# EAGLE design lpc11u24mini (EAGLE 6.6.0)
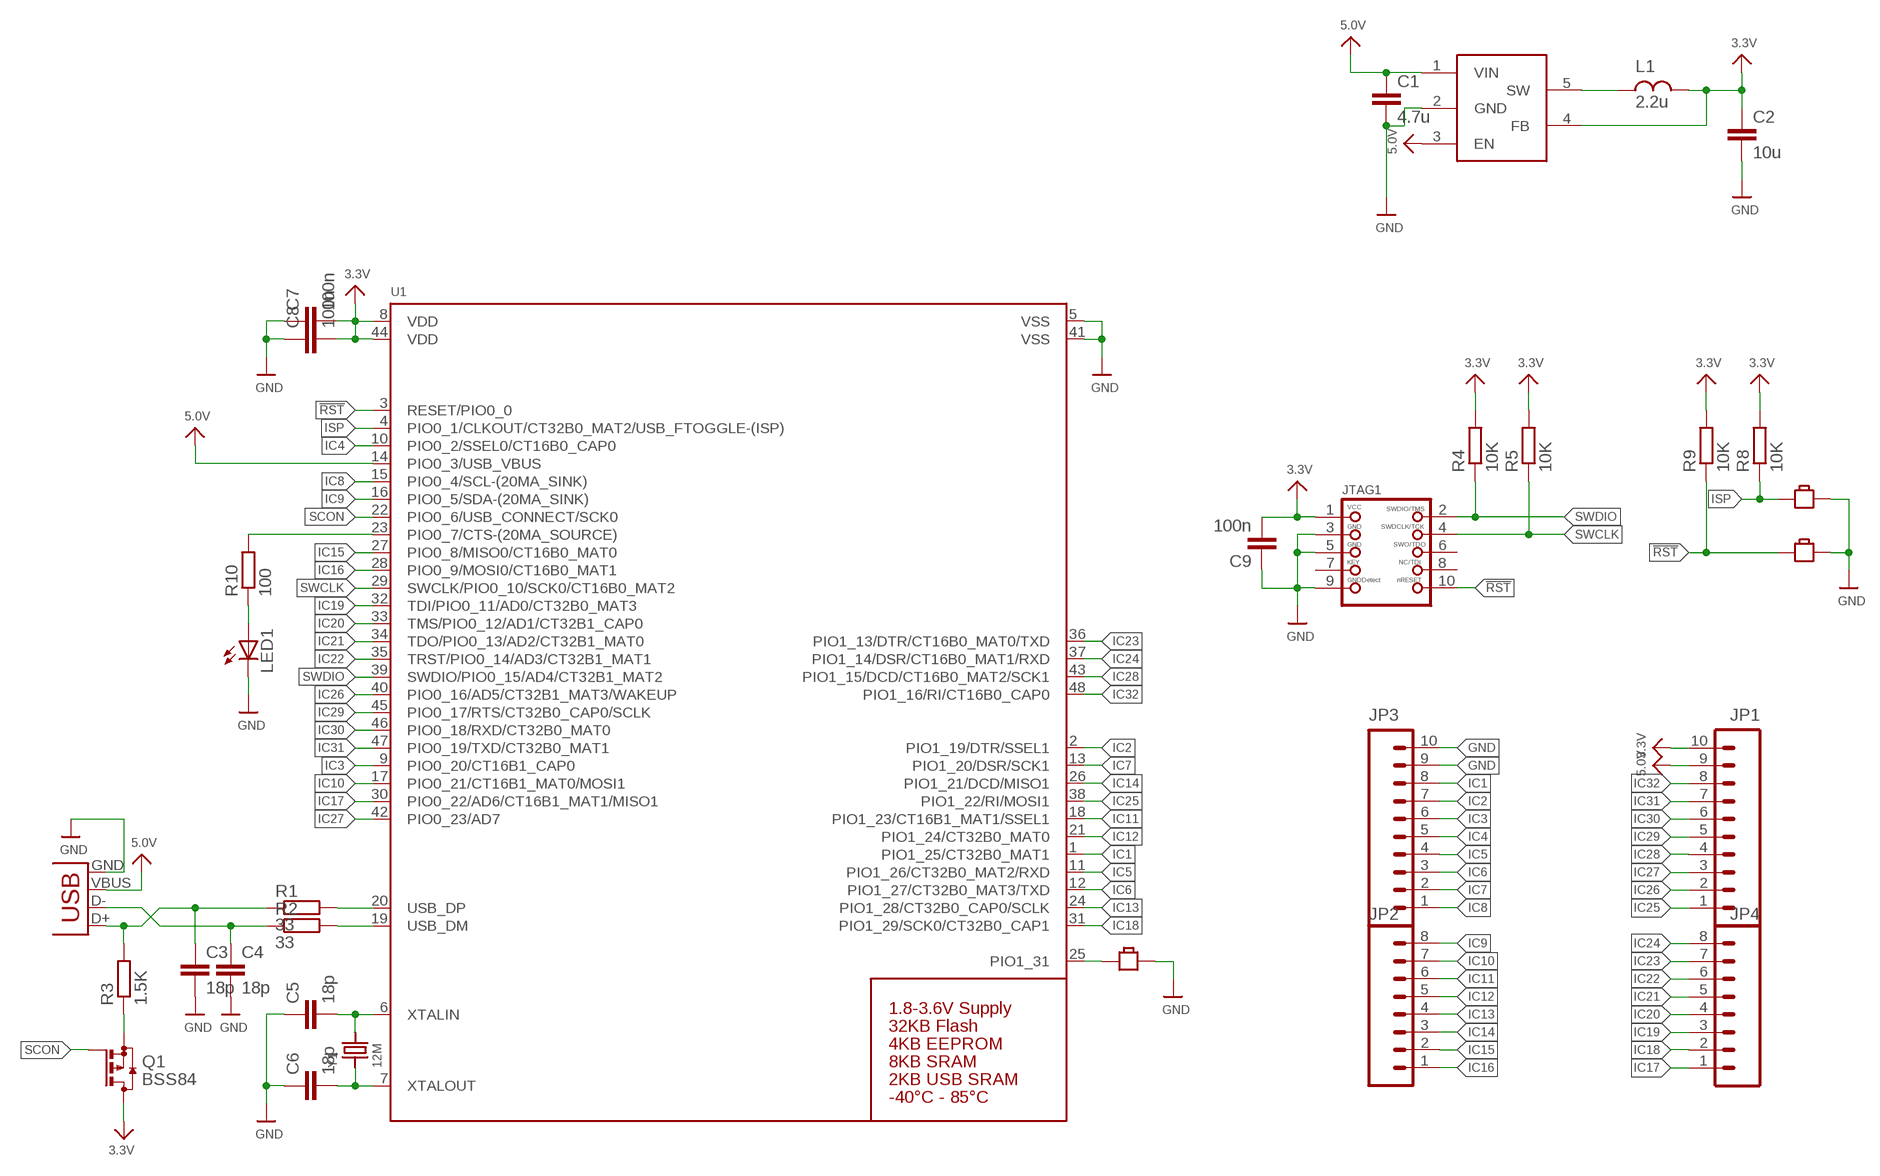
[diagram p0: schematic, sheet 1]

## Parts
B1  BUTTON-SMD-2P  [BUTTON_2P_SMD]
B2  BUTTON-SMD-2P  [BUTTON_2P_SMD]
B3  BUTTON-SMD-2P  [BUTTON_2P_SMD]
C1  4.7u  C-EUC0603  [C0603]
C2  10u  C-EUC0603  [C0603]
C3  18p  C-EUC0603  [C0603]
C4  18p  C-EUC0603  [C0603]
C5  18p  C-EUC0603  [C0603]
C6  18p  C-EUC0603  [C0603]
C7  100n  C-EUC0603  [C0603]
C8  100n  C-EUC0603  [C0603]
C9  100n  C-EUC0603  [C0603]
JP1  M10SMD_MALE  [1X10_SMD_MALE]
JP2  M08SMD-MALE  [1X08_SMD_MALE]
JP3  M10SMD_MALE  [1X10_SMD_MALE]
JP4  M08SMD-MALE  [1X08_SMD_MALE]
JTAG1  JTAG-CORTEXM3  [2X05_1.27MM_SMT]
L1  2.2u  L_SNR2512  [SRN2512]
LED1  LEDSML0805  [SML0805]
Q1  BSS84  [SOT23]
R1  33  R-EU_R0603  [R0603]
R2  33  R-EU_R0603  [R0603]
R3  1.5K  R-EU_R0603  [R0603]
R4  10K  R-EU_R0603  [R0603]
R5  10K  R-EU_R0603  [R0603]
R8  10K  R-EU_R0603  [R0603]
R9  10K  R-EU_R0603  [R0603]
R10  100  R-EU_R0603  [R0603]
U1  LPC11U24_QFP48  [LQFP48]
U$3  LM3671  [SOT23-5]
X1  USB-MICROB  [USB-MICROB]
Y1  12M  CRYSTALTHIN  [CRYSTAL_3.2X2.5]

## Nets
3.3V: C2.1 C7.2 C8.2 C9.2 JP1.10 JTAG1.1 L1.P$2 Q1.3(D) R4.2 R5.2 R8.2 R9.2 U1.8(VDD) U1.44(VDD) U$3.4(FB)
5.0V: C1.1 JP1.9 U1.14(PIO0_3/USB_VBUS) U$3.1(VIN) U$3.3(EN) X1.VBUS
!RST: B2.1 JTAG1.10 R9.1 U1.3(RESET/PIO0_0)
D_N: C4.1 R2.1 X1.D-
D_P: C3.1 R1.1 R3.2 X1.D+
DR_N: R2.2 U1.19(USB_DM)
DR_P: R1.2 U1.20(USB_DP)
GND: B1.P$2 B2.P$2 B3.P$2 C1.2 C2.2 C3.2 C4.2 C5.1 C6.1 C7.1 C8.1 C9.1 JP3.9 JP3.10 JTAG1.3 JTAG1.5 JTAG1.9 LED1.C U1.5(VSS) U1.41(VSS) U$3.2(GND) X1.GND
IC1: JP3.8 U1.1(PIO1_25/CT32B0_MAT1)
IC2: JP3.7 U1.2(PIO1_19/DTR/SSEL1)
IC3: JP3.6 U1.9(PIO0_20/CT16B1_CAP0)
IC4: JP3.5 U1.10(PIO0_2/SSEL0/CT16B0_CAP0)
IC5: JP3.4 U1.11(PIO1_26/CT32B0_MAT2/RXD)
IC6: JP3.3 U1.12(PIO1_27/CT32B0_MAT3/TXD)
IC7: JP3.2 U1.13(PIO1_20/DSR/SCK1)
IC8: JP3.1 U1.15(PIO0_4/SCL-(20MA_SINK))
IC9: JP2.8 U1.16(PIO0_5/SDA-(20MA_SINK))
IC10: JP2.7 U1.17(PIO0_21/CT16B1_MAT0/MOSI1)
IC11: JP2.6 U1.18(PIO1_23/CT16B1_MAT1/SSEL1)
IC12: JP2.5 U1.21(PIO1_24/CT32B0_MAT0)
IC13: JP2.4 U1.24(PIO1_28/CT32B0_CAP0/SCLK)
IC14: JP2.3 U1.26(PIO1_21/DCD/MISO1)
IC15: JP2.2 U1.27(PIO0_8/MISO0/CT16B0_MAT0)
IC16: JP2.1 U1.28(PIO0_9/MOSI0/CT16B0_MAT1)
IC17: JP4.1 U1.30(PIO0_22/AD6/CT16B1_MAT1/MISO1)
IC18: JP4.2 U1.31(PIO1_29/SCK0/CT32B0_CAP1)
IC19: JP4.3 U1.32(TDI/PIO0_11/AD0/CT32B0_MAT3)
IC20: JP4.4 U1.33(TMS/PIO0_12/AD1/CT32B1_CAP0)
IC21: JP4.5 U1.34(TDO/PIO0_13/AD2/CT32B1_MAT0)
IC22: JP4.6 U1.35(TRST/PIO0_14/AD3/CT32B1_MAT1)
IC23: JP4.7 U1.36(PIO1_13/DTR/CT16B0_MAT0/TXD)
IC24: JP4.8 U1.37(PIO1_14/DSR/CT16B0_MAT1/RXD)
IC25: JP1.1 U1.38(PIO1_22/RI/MOSI1)
IC26: JP1.2 U1.40(PIO0_16/AD5/CT32B1_MAT3/WAKEUP)
IC27: JP1.3 U1.42(PIO0_23/AD7)
IC28: JP1.4 U1.43(PIO1_15/DCD/CT16B0_MAT2/SCK1)
IC29: JP1.5 U1.45(PIO0_17/RTS/CT32B0_CAP0/SCLK)
IC30: JP1.6 U1.46(PIO0_18/RXD/CT32B0_MAT0)
IC31: JP1.7 U1.47(PIO0_19/TXD/CT32B0_MAT1)
IC32: JP1.8 U1.48(PIO1_16/RI/CT16B0_CAP0)
ISP: B1.1 R8.1 U1.4(PIO0_1/CLKOUT/CT32B0_MAT2/USB_FTOGGLE-(ISP))
LED: R10.2 U1.23(PIO0_7/CTS-(20MA_SOURCE))
N$1: B3.1 U1.25(PIO1_31)
N$3: L1.P$1 U$3.5(SW)
N$4: Q1.2(S) R3.1
N$5: C6.2 U1.7(XTALOUT) Y1.1
N$6: C5.2 U1.6(XTALIN) Y1.2
N$7: LED1.A R10.1
SCON: Q1.1(G) U1.22(PIO0_6/USB_CONNECT/SCK0)
SWCLK: JTAG1.4 R5.1 U1.29(SWCLK/PIO0_10/SCK0/CT16B0_MAT2)
SWDIO: JTAG1.2 R4.1 U1.39(SWDIO/PIO0_15/AD4/CT32B1_MAT2)
Unconnected: JTAG1.6 JTAG1.7 JTAG1.8

## Library data of the parts
B1-B3 = JAEB:BUTTON-SMD-2P: BAS014
C1-C9 = rcl:C-EU: CAPACITOR, European symbol
JP1 JP3 = SparkFun-Connectors:M10: Header 10 Standard 10-pin 0.1" header. Use with straight break away headers (SKU : PRT-00116), right angle break away headers (PRT-00553), swiss pins (PRT-00743), machine pins (PRT-00117), and female headers (PRT-00115).; PROD_ID: CONN-11291
JP2 JP4 = SparkFun-Connectors:M08: Header 8 Standard 8-pin 0.1" header. Use with straight break away headers (SKU : PRT-00116), right angle break away headers (PRT-00553), swiss pins (PRT-00743), machine pins (PRT-00117), and female headers (PRT-00115).; PROD_ID: CONN-11292
JTAG1 = microbuilder:JTAG-CORTEXM3: Serial Wire (SW-DP) Connector This standard 0.05" 10-pin connector is for use with the Cortex M0/M3's native SWD (serial wire debugger) interface (SW-DP). Some boards support a 20-pin combined JTAG+SWD connector (SWJ-DP), such as the LPC1700 family, but many smaller devices only work with SWD which typically use the smaller 10-pin SW-DP connecter (the LPC1300 family, for example, only supports SWD). 2x05 1.27mm/0.05" Connector: This is the standard SMT connector defined by ARM for all Cortex devices, and should be used in most situations and for forward-compatibility since any new devices coming to market will likely use this connector. MOLEX 10 Pin 0.1" Connector: This 0.1" 10 pin connector has the same pin layout as the standard 0.05" connector, but is easier to work with if you are using standard jumper wires or custom cables to connect your SWD hardware. MOLEX 20 Pin 0.1" Connector: This 0.1" 20 pin connector is the same model used for ARM7/ARM9 JTAG debuggers, but is connected to match the pins on the Segger J-Link for ARM (which supports both JTAG and SWD debugging). See the following document from ARM for more information on Cortex M3 Debug Connectors: http://infocenter.arm.com/help/topic/com.arm.doc.faqs/attached/13634/cortex_debug_connectors.pdf And the following page for an overview with images of the different connector types: http://www.keil.com/peripherals/coresight/connectors.asp
L1 = JAEB:L
LED1 = led:LED: LED OSRAM: - CHIPLED LG R971, LG N971, LY N971, LG Q971, LY Q971, LO R971, LY R971 LH N974, LH R974 LS Q976, LO Q976, LY Q976 LO Q996 - Hyper CHIPLED LW Q18S LB Q993, LB Q99A, LB R99A - SideLED LS A670, LO A670, LY A670, LG A670, LP A670 LB A673, LV A673, LT A673, LW A673 LH A674 LY A675 LS A676, LA A676, LO A676, LY A676, LW A676 LS A679, LY A679, LG A679 - Hyper Micro SIDELED® LS Y876, LA Y876, LO Y876, LY Y876 LT Y87S - SmartLED LW L88C, LW L88S LB L89C, LB L89S, LG L890 LS L89K, LO L89K, LY L89K LS L896, LA L896, LO L896, LY L896 - TOPLED LS T670, LO T670, LY T670, LG T670, LP T670 LSG T670, LSP T670, LSY T670, LOP T670, LYG T670 LG T671, LOG T671, LSG T671 LB T673, LV T673, LT T673, LW T673 LH T674 LS T676, LA T676, LO T676, LY T676, LB T676, LH T676, LSB T676, LW T676 LB T67C, LV T67C, LT T67C, LS T67K, LO T67K, LY T67K, LW E67C LS E67B, LA E67B, LO E67B, LY E67B, LB E67C, LV E67C, LT E67C LW T67C LS T679, LY T679, LG T679 LS T770, LO T770, LY T770, LG T770, LP T770 LB T773, LV T773, LT T773, LW T773 LH T774 LS E675, LA E675, LY E675, LS T675 LS T776, LA T776, LO T776, LY T776, LB T776 LHGB T686 LT T68C, LB T68C - Hyper Mini TOPLED® LB M676 - Mini TOPLED Santana® LG M470 LS M47K, LO M47K, LY M47K Source: http://www.osram.convergy.de LUXEON: - LUMILED® LXK2-PW12-R00, LXK2-PW12-S00, LXK2-PW14-U00, LXK2-PW14-V00 LXK2-PM12-R00, LXK2-PM12-S00, LXK2-PM14-U00 LXK2-PE12-Q00, LXK2-PE12-R00, LXK2-PE12-S00, LXK2-PE14-T00, LXK2-PE14-U00 LXK2-PB12-K00, LXK2-PB12-L00, LXK2-PB12-M00, LXK2-PB14-N00, LXK2-PB14-P00, LXK2-PB14-Q00 LXK2-PR12-L00, LXK2-PR12-M00, LXK2-PR14-Q00, LXK2-PR14-R00 LXK2-PD12-Q00, LXK2-PD12-R00, LXK2-PD12-S00 LXK2-PH12-R00, LXK2-PH12-S00 LXK2-PL12-P00, LXK2-PL12-Q00, LXK2-PL12-R00 Source: www.luxeon.com KINGBRIGHT: KA-3528ASYC Source: www.kingbright.com
Q1 = transistor-small-signal:BSS84: P-CHANNEL MOS FET
R1-R5 R8-R10 = rcl:R-EU_: RESISTOR, European symbol
U1 = microbuilder:LPC11U24_QFP48: LPC11U24 - ARM Cortex M0 50MHz MCU Supply: 1.8-3.6V Flash: 32KB EEPROM: 4KB SRAM: 8KB + 2KB USB Temp: -40°C - 85°C
U$3 = JAEB:LM3671
X1 = brc-electronics:USB: USB Connectors USB-B-PTH is fully proven SKU : PRT-00139 USB-miniB is fully proven SKU : PRT-00587 USB-A-PCB is untested. USB-A-H is throughly reviewed, but untested. Spark Fun Electronics SKU : PRT-00437 USB-B-SMT is throughly reviewed, but untested. Needs silkscreen touching up. USB-A-S has not been used/tested USB-MB-H has not been used/tested
Y1 = microbuilder:CRYSTAL: Crystals HC49UP - Surface Mount Crystal 4.0MHz 18pF +/-30ppm Surface Mount Crystal [Digikey: 535-9857-1-ND] 12.0 MHz Surface Mount Crystal [Digikey: 535-9869-6-ND] 25.0 MHz Surface Mount Crystal [Digikey: 535-9078-1-ND] 2.5 x 2.0mm - MEMs SMT Crystal 16.0 MHz 10pF 20ppm 2.5 x 2.0mm Crystal [Digikey -40-85°C: 535-10923-1-ND] 3.2 x 2.5mm - MEMs SMT Crystal 12.0 MHz 8pF 15ppm 3.2 x 2.5mm Crystal [Digikey: -10-70°C: 644-1047-1-ND -40-125°C: 644-1128-1-ND] 16.0 MHz 8pF 15ppm 3.2 x 2.5mm Crystal [Digikey: -10-70°C: 644-1049-1-ND -40-125°C: 644-1129-2-ND] 16.0 MHz 10pF 10ppm 3.2 x 2.5mm Crystal [Digikey: 644-1100-1-ND] 27.12 MHz 18pF 30ppm 3.2 x 2.5mm Crystal [Digikey: 887-1424-1-ND] 27.12MHz 10pF 10ppm 3.2 x 2.5mm Crystal [Digikey: 887-1329-1-ND] 4.9 x 1.8mm - MEMs SMT Crystal 32.768 KHz 12.5pF 20ppm 4.9 x 1.8mm Crystal [Digikey: SE2415CT-ND] 8.0 x 3.8mm - Surface Mount Crystal 32.768kHz 12.5pF 20ppm -40°C-85°C [Digikey: 535-9166-2-ND] Cylinder 32.768KHz Cylinder Crystal (2x6mm body) [Ex. Digikey: 300-8341-2-ND]

## Board
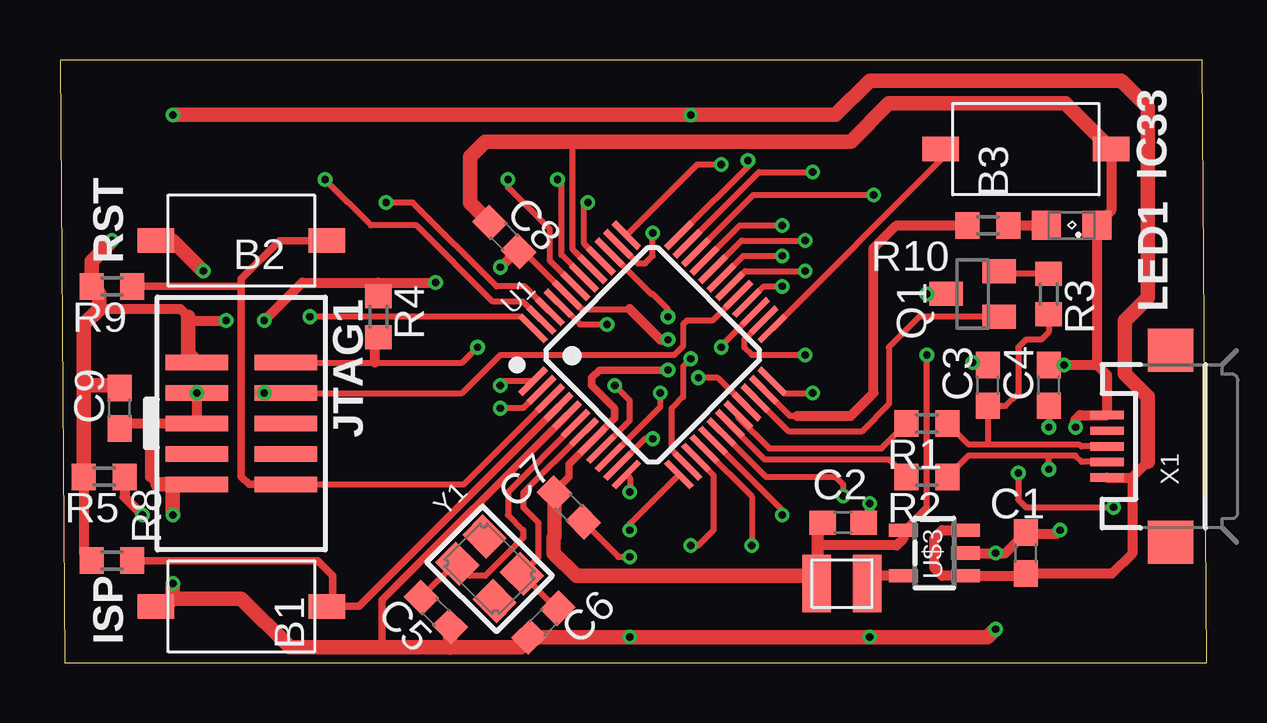
[diagram p1: board, top side]
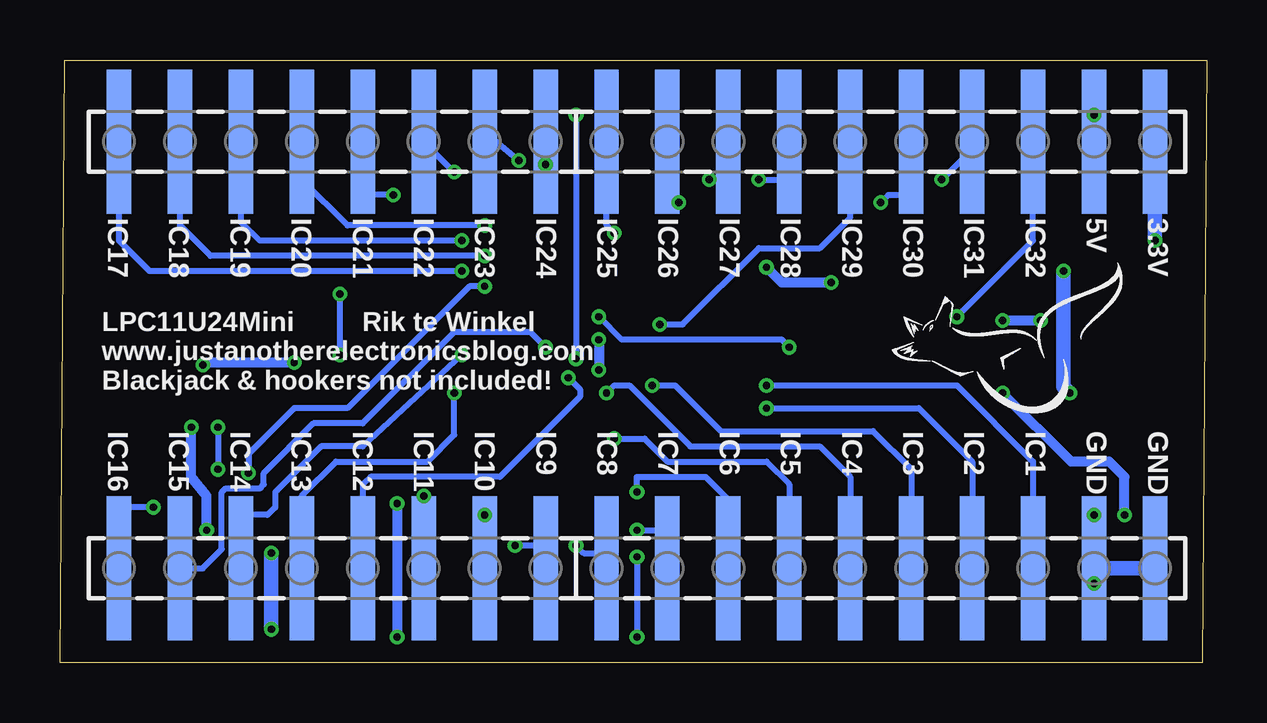
[diagram p2: board, bottom side, seen from below]

Size 47.8 x 25.11 mm. Coordinates in mm from the lower left corner, seen from the top.
Outline: 0.2,0 47.8,0 47.61,25.11 0,25.11 0.2,0
Copper layers (1*16): Top 0.035mm / dielectric 1.5mm / Bottom 0.035mm
Design rules "Elecrow_2-layer_eagle_rule": minimum track width 6mil, minimum drill 12mil, track to track 6mil, track to pad 6mil, pad to pad 6mil, via to via 6mil, smd to smd 0mil, copper to edge 10mil, drill to drill 10mil, minimum pad ring 10mil, minimum via ring 6mil, stop-mask expansion 2mil, vias tented up to drill 100mil, thermal gap 10mil

### Footprints (pad centres in the part's own frame; a part is rotated, then mirrored left to right if it is on the bottom)
BUTTON_2P_SMD = smd 1.524 x 1.016: 1 -3.556,0; P$2 3.556,0
C0603 = smd 1.1 x 1: 1 -0.85,0; 2 0.85,0
1X10_SMD_MALE = smd 1.02 x 6: 1 0,0; 2 2.54,0; 3 5.08,0; 4 7.62,0; 5 10.16,0; 6 12.7,0; 7 15.24,0; 8 17.78,0; 9 20.32,0; 10 22.86,0
1X08_SMD_MALE = smd 1.02 x 6: 1 0,0; 2 2.54,0; 3 5.08,0; 4 7.62,0; 5 10.16,0; 6 12.7,0; 7 15.24,0; 8 17.78,0
2X05_1.27MM_SMT = smd 0.65 x 2.6: 1 -2.54,-1.85; 2 -2.54,1.85; 3 -1.27,-1.85; 4 -1.27,1.85; 5 0,-1.85; 6 0,1.85; 7 1.27,-1.85; 8 1.27,1.85; 9 2.54,-1.85; 10 2.54,1.85
SRN2512 = smd 1.2 x 2.4: P$1 -1,0; P$2 1.1,0
SML0805 = smd 1.2 x 1.2: A 1.05,0; C -1.05,0
SOT23 = smd 1 x 1.4: 1 -0.95,-1.1; 2 0.95,-1.1; 3 0,1.1
R0603 = smd 1 x 1.1: 1 -0.85,0; 2 0.85,0
LQFP48 = smd 1.5 x 0.25: 1 -4.3,2.75; 2 -4.3,2.25; 3 -4.3,1.75; 4 -4.3,1.25; 5 -4.3,0.75; 6 -4.3,0.25; 7 -4.3,-0.25; 8 -4.3,-0.75; 9 -4.3,-1.25; 10 -4.3,-1.75; 11 -4.3,-2.25; 12 -4.3,-2.75; 25 4.3,-2.75; 26 4.3,-2.25; 27 4.3,-1.75; 28 4.3,-1.25; 29 4.3,-0.75; 30 4.3,-0.25; 31 4.3,0.25; 32 4.3,0.75; 33 4.3,1.25; 34 4.3,1.75; 35 4.3,2.25; 36 4.3,2.75 | smd 0.25 x 1.5: 13 -2.75,-4.3; 14 -2.25,-4.3; 15 -1.75,-4.3; 16 -1.25,-4.3; 17 -0.75,-4.3; 18 -0.25,-4.3; 19 0.25,-4.3; 20 0.75,-4.3; 21 1.25,-4.3; 22 1.75,-4.3; 23 2.25,-4.3; 24 2.75,-4.3; 37 2.75,4.3; 38 2.25,4.3; 39 1.75,4.3; 40 1.25,4.3; 41 0.75,4.3; 42 0.25,4.3; 43 -0.25,4.3; 44 -0.75,4.3; 45 -1.25,4.3; 46 -1.75,4.3; 47 -2.25,4.3; 48 -2.75,4.3
SOT23-5 = smd 0.55 x 1.2: 1 -0.95,-1.3; 2 0,-1.3; 3 0.95,-1.3; 4 0.95,1.3; 5 -0.95,1.3
USB-MICROB = smd 0.35 x 1.4: D+ 0,2.65; D- -0.65,2.65; GND 1.3,2.65; ID 0.65,2.65; VBUS -1.3,2.65 | smd 1.8 x 1.9: MT1 -4,0; MT2 4,0
CRYSTAL_3.2X2.5 = smd 1.4 x 1.2: 1 -1.1,-0.8; 2 1.1,0.8; GND1 -1.1,0.8; GND2 1.1,-0.8

### Placement (x,y rotation side)
B1  7.56,2.34 180 top
B2  7.56,17.58 180 top
B3  40.26,21.39 0 top
C1  40.26,4.56 90 top
C2  32.64,5.83 0 top
C3  38.68,11.55 90 top
C4  41.22,11.55 90 top
C5  15.66,2.11 135 top
C6  20.15,1.66 45 top
C7  21.21,6.47 135 top
C8  18.52,17.74 315 top
C9  2.48,10.6 90 top
JP1  25.02,21.71 0 bottom
JP2  45.34,3.93 0 bottom
JP3  25.02,3.93 0 bottom
JP4  45.34,21.71 0 bottom
JTAG1  7.56,9.96 270 top
L1  32.64,3.29 180 top
LED1  42.17,18.21 180 top
Q1  38.04,15.36 90 top
R1  36.14,9.96 180 top
R2  36.14,7.74 180 top
R3  41.22,15.36 270 top
R4  13.28,14.41 90 top
R5  1.85,7.74 180 top
R8  2.16,4.25 180 top
R9  2.16,15.68 180 top
R10  38.68,18.21 180 top
U1  24.71,12.82 45 top
U$3  36.45,4.56 90 top
X1  46.3,9.01 90 top
Y1  17.91,3.9 135 top

### Tracks (layer width: path | path; a pad name or v marks a point on that pad's centre or on a via)
3.3V  (via drill 0.3)
  Top 0.254: U$3.4 36.14,6.5 v36.14,12.82 | v36.14,15.36 Q1.3 | 23.75,14.72 21.74,14.72 U1.44 19.48,16.98 C8.2 19.03,17.14 | 20.61,7.14 C7.2 | 31.54,5.58 31.69,5.43 31.69,3.93 | 5.34,14.41 5.5,14.25
  Top 0.305: v25.34,12.18 22.48,12.18 22.17,11.87 22.17,11.55 23.12,10.6 23.12,10.17 U1.8 21.21,8.26 21.21,7.74 20.61,7.14
  Top 0.406: L1.P$2 31.54,4.88 | 31.54,4.88 31.54,5.58 C2.1 | U$3.4 35.15,5.17 34.87,4.88 31.54,4.88 | 23.75,14.72 25.02,13.45 v25.34,13.45 | 5.34,14.41 5.02,14.72 1.63,14.72 | R5.2 1,4.56 R8.2 | 5.5,14.25 v6.93,14.25 | v8.51,14.25 10.1,15.83 13.28,15.83 | 13.28,15.83 v15.66,15.83 | v18.36,16.47 19.03,17.14 | R4.2 13.28,15.83
  Top 0.61: 31.69,3.93 31.37,3.61 21.53,3.61 20.58,4.56 20.58,5.2 20.61,5.23 C7.2 | 1,11.55 R5.2 | C9.2 2.38,11.55 1,11.55 | JTAG1.1 5.34,12.87 5.34,14.41 | v2.16,17.58 1.31,16.73 R9.2 1.63,15.36 1.63,14.72 1,14.09 1,11.55
  Bottom 0.254: v36.14,12.82 v36.14,15.36
  Bottom 0.406: v25.34,13.45 v25.34,12.18 | v6.93,14.25 v8.51,14.25 | v15.66,15.83 17.72,15.83 v18.36,16.47
  Bottom 0.61: v2.16,17.58 JP1.10
5.0V  (via drill 0.3)
  Top 0.254: 36.45,3.93 36.77,3.61 | U1.14 25.5,8.84 25.5,10.6 25.98,11.07 25.98,12.34 v26.29,12.66
  Top 0.406: U$3.3 36.77,5.51 36.45,5.2 36.45,3.93 36.77,3.61 U$3.1 40.16,3.61 C1.1 43.86,3.71 44.71,4.56 44.71,7.71 44.68,7.71 | X1.VBUS 44.68,7.71 | 44.68,7.71 45.34,8.37
  Top 0.61: v4.7,22.82 v26.29,22.82 32.33,22.82 33.76,24.25 44.23,24.25 45.34,23.14 45.34,15.2 44.39,14.25 44.39,12.02 45.34,11.07 45.34,8.37
  Bottom 0.254: v26.29,22.82 v26.29,12.66
  Bottom 0.61: JP1.9 v4.7,22.82
!RST
  Top 0.254: JTAG1.10 16.83,7.42 U1.3
  Top 0.305: B2.1 9.15,17.58 7.56,15.99 7.56,15.68 | 7.56,15.68 7.56,7.74 7.88,7.42 JTAG1.10 | R9.1 7.56,15.68
D_N  (via drill 0.3)
  Top 0.254: X1.D- 42.59,8.36 42.33,8.62 41.22,8.62 | 41.22,8.62 37.87,8.62 R2.1 | C4.1 v41.22,9.8 | v41.22,8.06 41.22,8.62
  Bottom 0.254: v41.22,9.8 v41.22,8.06
D_P
  Top 0.254: X1.D+ 42.58,9.01 42.49,9.08 38.68,9.08 | 38.68,9.08 37.87,9.08 R1.1 | 38.68,9.08 C3.1 39.41,10.7 39.95,11.23 39.95,13.14 40.26,13.45 40.9,13.45 41.22,13.77 R3.2
DR_N
  Top 0.254: U1.19 27.92,9.91 29.37,8.46 34.56,8.46 R2.2
DR_P
  Top 0.254: U1.20 28.28,10.21 29.56,8.92 34.25,8.92 R1.2
GND  (via drill 0.3)
  Top 0.254: U1.41 21.37,17.21 21.37,21.71 | C7.1 23.28,4.4 v23.75,4.4
  Top 0.305: U1.5 13.44,2.61 13.44,0.64
  Top 0.406: U$3.2 v38.99,4.56 39.41,4.56 C1.2 40.32,5.36 41.53,5.36 v41.69,5.51 | C9.1 2.7,9.96 3.75,9.96 | 3.75,9.96 JTAG1.5 JTAG1.3 | JTAG1.9 4.7,7.42 | 4.07,7.42 3.75,7.74 3.75,9.96 | 43.22,12.4 v41.85,12.4 C4.2 | 43.22,12.4 43.65,11.98 X1.GND 42.52,10.31 42.33,10.12 v42.33,9.8 | 43.22,12.4 LED1.C 43.82,18.82 B3.P$2 | C3.2 38.14,12.4 v38.04,12.5 | C2.2 33.76,6.09 v33.76,6.63
  Top 0.61: B2.P$2 4.7,17.58 v5.97,16.31 | 5.02,11.23 JTAG1.3 | B1.P$2 4.39,2.34 4.7,2.66 | 4.7,2.66 v4.7,3.29 | 4.07,7.42 4.7,7.42 v4.7,6.15 | 4.7,2.66 7.56,2.66 9.58,0.64 13.44,0.64 16.45,0.64 | 16.45,0.64 19.23,0.64 C6.1 v23.75,1.06 v33.76,1.06 38.66,1.06 v38.99,1.39 | C5.1 16.26,0.62 16.45,0.64 | C8.1 18.07,18.18 17.09,19.17 17.09,21.07 17.72,21.71 21.37,21.71 32.96,21.71 34.55,23.3 41.91,23.3 B3.P$2
  Bottom 0.254: v23.75,4.4 v23.75,1.06
  Bottom 0.406: v38.04,12.5 41.75,12.5 v41.85,12.4 | v33.76,6.63 v33.76,1.06 | v41.69,5.51 41.69,6.94 42.33,7.74 v42.33,9.8
  Bottom 0.61: v5.97,16.31 5.97,11.49 JTAG1.3 | JP3.10 JP3.9 v4.7,3.29 v4.7,6.15 | v38.99,1.39 v38.99,4.56
  other vias: 5.71,11.23
IC1  (via drill 0.3)
  Top 0.254: U1.1 18.53,11.72 v18.36,11.55
  Bottom 0.254: v18.36,11.55 10.42,11.55 7.24,8.37 JP3.8
IC2  (via drill 0.3)
  Top 0.254: U1.2 19.31,10.6 v18.36,10.6
  Bottom 0.254: v18.36,10.6 12.01,10.6 9.78,8.37 JP3.7
IC3  (via drill 0.3)
  Top 0.254: U1.9 23.75,10.1 23.75,10.91 v23.12,11.55
  Bottom 0.254: v23.12,11.55 22.17,11.55 20.26,9.64 13.91,9.64 12.32,8.06 JP3.6
IC4  (via drill 0.3)
  Top 0.254: U1.10 25.02,10.66 v25.02,11.23
  Bottom 0.254: v25.02,11.23 24.71,11.55 24.07,11.55 21.53,9.01 16.13,9.01 14.86,7.74 JP3.5
IC5  (via drill 0.3)
  Top 0.254: U1.11 24.4,9.33 v24.71,9.33
  Bottom 0.254: v24.71,9.33 23.44,9.33 22.48,8.37 18.36,8.37 17.4,7.42 JP3.4
IC6  (via drill 0.3)
  Top 0.254: U1.12 23.75,7.69 v23.75,7.1
  Bottom 0.254: v23.75,7.1 23.75,7.74 20.9,7.74 19.94,6.79 JP3.3
IC7  (via drill 0.3)
  Top 0.254: U1.13 23.75,5.78 v23.75,5.51
  Bottom 0.254: v23.75,5.51 22.48,5.51 JP3.2
IC8  (via drill 0.3)
  Top 0.254: U1.15 27.25,7.8 27.25,5.51 26.61,4.88 v26.29,4.88
  Bottom 0.254: v26.29,4.88 25.98,4.56 25.02,4.56 JP3.1
IC9  (via drill 0.3)
  Top 0.254: U1.16 28.83,6.92 v28.83,4.88
  Bottom 0.254: v28.83,4.88 27.56,4.88 JP2.8
IC10  (via drill 0.3)
  Top 0.254: U1.17 30.1,6.36 v30.1,6.15
  Bottom 0.254: v30.1,6.15 JP2.7
IC11  (via drill 0.3)
  Top 0.254: U1.18 29.43,7.74 32.33,7.74 32.64,7.42 v32.64,6.94
  Bottom 0.254: 32.64,4.88 JP2.6 v32.64,6.94
IC12  (via drill 0.3)
  Top 0.254: U1.21 27.43,11.87 v26.61,11.87
  Bottom 0.254: v26.61,11.87 26.14,11.39 26.14,11.07 29.47,7.74 34.87,7.74 35.18,7.42 JP2.5
IC13  (via drill 0.3)
  Top 0.254: U1.24 30.18,11.23 v31.37,11.23
  Bottom 0.254: v31.37,11.23 31.37,9.48 32.48,8.37 36.3,8.37 37.72,6.94 JP2.4
IC14  (via drill 0.3)
  Top 0.254: U1.26 28.52,13.45 28.52,13.14 28.83,12.82 v31.06,12.82
  Bottom 0.254: v31.06,12.82 35.18,9.01 36.93,9.01 38.84,7.1 38.84,6.47 39.15,6.15 40.42,6.15 40.42,4.09 JP2.3
IC15  (via drill 0.3)
  Top 0.254: U1.27 27.56,13.2 v27.56,13.14
  Bottom 0.254: v27.56,13.14 28.2,13.77 31.37,13.77 35.18,9.96 37.25,9.96 39.31,7.9 39.31,7.42 39.47,7.26 40.9,7.26 41.06,7.1 41.06,4.72 41.85,3.93 JP2.2
IC16  (via drill 0.3)
  Top 0.254: U1.28 29.33,15.68 v30.1,15.68 | v39.95,7.9 39.95,6.79 40.26,6.47 v43.91,6.47
  Bottom 0.254: v30.1,15.68 30.74,15.68 35.82,10.6 38.04,10.6 39.95,8.69 v39.95,7.9 | v43.91,6.47 45.19,6.47 45.19,4.09 JP2.1
IC17  (via drill 0.3)
  Top 0.254: U1.30 28.55,16.31 v31.06,16.31
  Bottom 0.254: v31.06,16.31 44.07,16.31 45.34,17.58 JP4.1
IC18  (via drill 0.3)
  Top 0.254: U1.31 28.48,16.95 v30.1,16.95
  Bottom 0.254: v30.1,16.95 41.53,16.95 42.8,18.21 JP4.2
IC19  (via drill 0.3)
  Top 0.254: U1.32 28.41,17.58 v31.06,17.58
  Bottom 0.254: v31.06,17.58 39.47,17.58 40.26,18.37 JP4.3
IC20  (via drill 0.3)
  Top 0.254: U1.33 28.34,18.21 v30.1,18.21
  Bottom 0.254: v30.1,18.21 35.82,18.21 37.72,20.12 JP4.4
IC21  (via drill 0.3)
  Top 0.254: U1.34 28.9,19.48 v33.91,19.48
  Bottom 0.254: v33.91,19.48 35.18,19.48 JP4.5
IC22  (via drill 0.3)
  Top 0.254: U1.35 29.14,20.44 v31.37,20.44
  Bottom 0.254: v31.37,20.44 JP4.6
IC23  (via drill 0.3)
  Top 0.254: U1.36 28.83,20.83 v28.68,20.91
  Bottom 0.254: v28.68,20.91 29.63,21.71 JP4.7
IC24  (via drill 0.3)
  Top 0.254: U1.37 26.56,20.75 v27.56,20.75
  Bottom 0.254: 27.56,19.8 v27.56,20.75 JP4.8
IC25  (via drill 0.3)
  Top 0.254: U1.38 24.08,16.63 24.39,16.63 24.71,16.95 v24.71,17.9
  Bottom 0.254: v24.71,17.9 25.02,18.21 JP1.1
IC26  (via drill 0.3)
  Top 0.254: U1.40 21.85,17.44 21.85,19.01 v22.01,19.17
  Bottom 0.254: v22.01,19.17 22.48,19.17 JP1.2
IC27  (via drill 0.3)
  Top 0.254: U1.42 20.9,16.98 20.9,19.96 v20.74,20.12
  Bottom 0.254: v20.74,20.12 19.94,20.12 JP1.3
IC28  (via drill 0.3)
  Top 0.254: U1.43 20.42,16.75 20.42,18.06 18.67,19.8 v18.67,20.12
  Bottom 0.254: v18.67,20.12 17.4,20.12 JP1.4
IC29  (via drill 0.3)
  Top 0.254: U1.45 21.67,14.09 v22.8,14.09
  Bottom 0.254: v22.8,14.09 21.85,14.09 18.67,17.26 16.13,17.26 14.86,18.53 JP1.5
IC30  (via drill 0.3)
  Top 0.254: U1.46 19.37,15.68 18.2,15.68 14.71,19.17 v13.59,19.17
  Bottom 0.254: v13.59,19.17 13.28,19.48 12.32,19.48 JP1.6
IC31  (via drill 0.3)
  Top 0.254: U1.47 19.3,15.04 18.04,15.04 14.86,18.21 12.96,18.21 v11.05,20.12
  Bottom 0.254: v11.05,20.12 9.78,21.39 JP1.7
IC32  (via drill 0.3)
  Top 0.254: U1.48 19.23,14.41 v10.42,14.41
  Bottom 0.254: v10.42,14.41 7.24,17.58 JP1.8
ISP
  Top 0.305: U1.4 12.46,2.34 B1.1 11.37,2.59 11.37,3.61 10.74,4.25 R8.1
LED
  Top 0.254: U1.23 30.43,10.28 30.74,10.28
  Top 0.406: 30.74,10.28 32.96,10.28 33.91,11.23 33.91,17.26 34.87,18.21 R10.2
N$1
  Top 0.254: U1.25 36.71,20.93 B3.1
N$3
  Top 0.406: U$3.5 33.96,3.61 L1.P$1
N$4
  Top 0.254: R3.1 39.24,16.21 Q1.2
N$5
  Top 0.254: C6.2 20.68,2.26 Y1.1 19.94,4.39 19.94,5.83 19.31,6.47 19.31,7.07 U1.7
N$6
  Top 0.254: U1.6 21.49,9.92 18.67,7.1 18.67,6.15 19.31,5.51 19.31,5.2 17.72,3.61 17.09,3.61 16.58,4.12 Y1.2 16.47,4.12 C5.2
N$7
  Top 0.406: R10.1 LED1.A
SCON
  Top 0.254: Q1.1 35.82,14.41 34.55,13.14 34.55,10.75 33.44,9.64 30.36,9.64 U1.22
SWCLK  (via drill 0.3)
  Top 0.254: JTAG1.4 16.77,11.23 18.36,12.82 25.61,12.82 25.98,13.19 25.98,14.09 26.14,14.25 27.2,14.25 U1.29
  Top 0.406: R5.1 2.7,6.89 v3.43,6.15 | v8.51,11.23 JTAG1.4
  Bottom 0.406: v3.43,6.15 3.43,7.74 4.07,8.37 5.66,8.37 v8.51,11.23
SWDIO  (via drill 0.3)
  Top 0.254: JTAG1.2 13.12,12.5 16.77,12.5 v17.4,13.14 | v25.34,14.41 25.34,14.72 24.71,15.36 24.64,15.36 U1.39
  Top 0.406: R4.1 13.12,13.4 13.12,12.5
  Bottom 0.254: v17.4,13.14 17.72,13.45 24.39,13.45 v25.34,14.41

### Text on the board
tNames: IC33 | RST | ISP
bNames: 3.3V / / 5V / / IC32 / / IC31 / / IC30 / / IC29 / / IC28 / / IC27 / / IC26 / / IC25 / / IC24 / / IC23 / / IC22 / / IC21 / / IC20 / / IC19 / / IC18 / / IC17 | LPC11U24Mini Rik te Winkel / www.justanotherelectronicsblog.com / Blackjack & hookers not included! | GND / / GND / / IC1 / / IC2 / / IC3 / / IC4 / / IC5 / / IC6 / / IC7 / / IC8 / / IC9 / / IC10 / / IC11 / / IC12 / / IC13 / / IC14 / / IC15 / / IC16